# Altium schematic sheet Mako DSP Arduio IO R1.2.SchDoc
size A
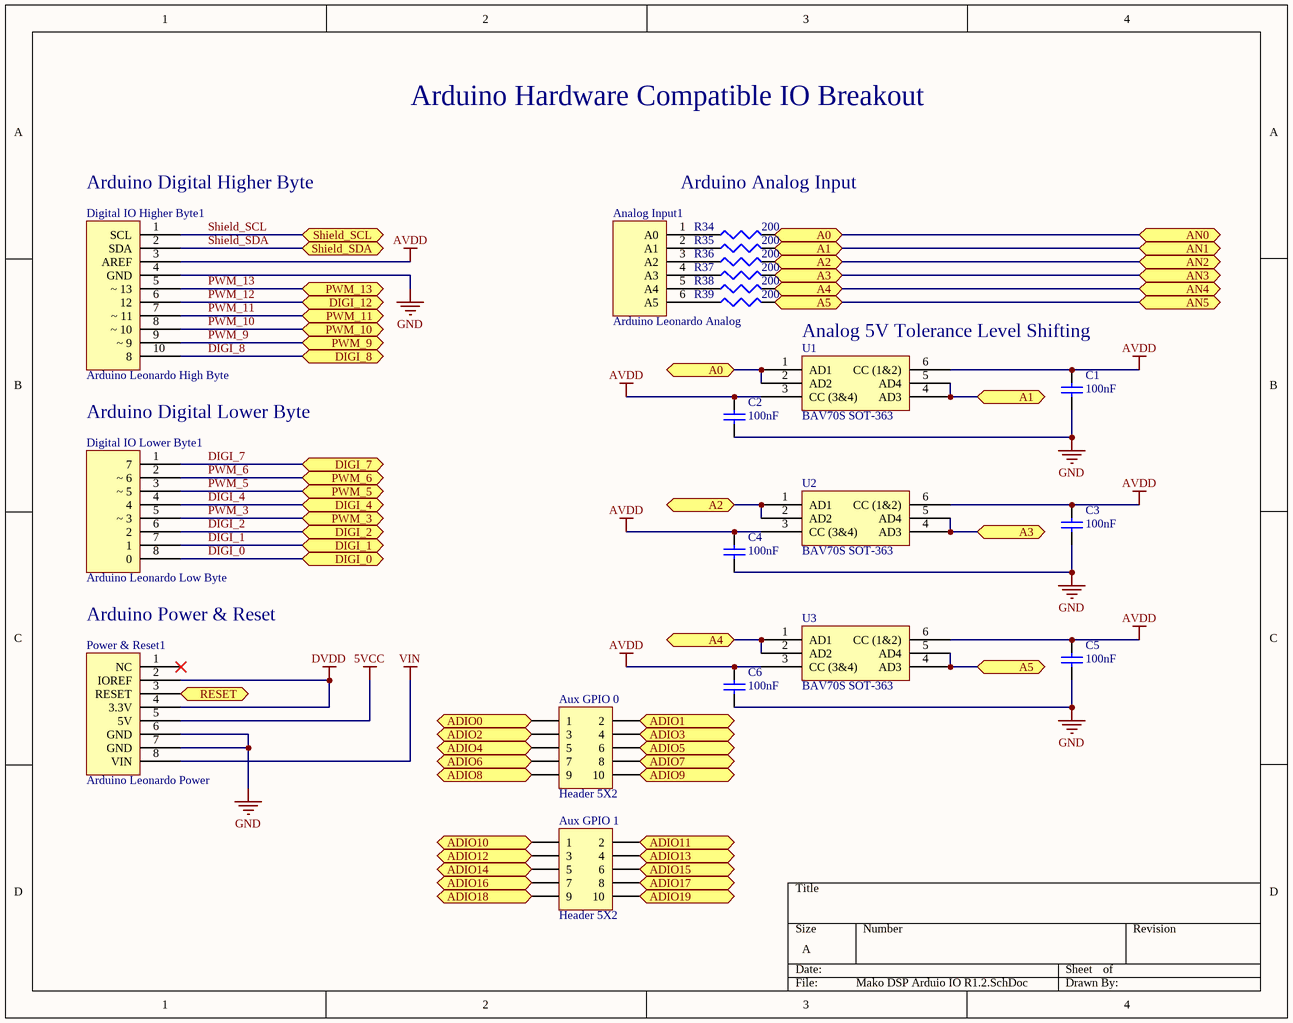
[diagram p0: Mako DSP Arduio IO R1.2.SchDoc]

## Parts
Analog_Input1  Arduino Leonardo Analog  [Arduino Leonardo Analog]
Aux_GPIO_0  Header 5X2  [HDR2X5]
Aux_GPIO_1  Header 5X2  [HDR2X5]
C1  value 100nF  [0402]  (hidden comment: Cap Semi)
C2  value 100nF  [0402]  (hidden comment: Cap Semi)
C3  value 100nF  [0402]  (hidden comment: Cap Semi)
C4  value 100nF  [0402]  (hidden comment: Cap Semi)
C5  value 100nF  [0402]  (hidden comment: Cap Semi)
C6  value 100nF  [0402]  (hidden comment: Cap Semi)
Digital_IO_Higher_Byte1  Arduino Leonardo High Byte  [Arduino Leonardo High Byte]
Digital_IO_Lower_Byte1  Arduino Leonardo Low Byte  [Arduino Leonardo Low Byte]
Power_&_Reset1  Arduino Leonardo Power  [Arduino Leonardo Power]
R34  value 200  [0402 - duplicate]  (hidden comment: Res3)
R35  value 200  [0402 - duplicate]  (hidden comment: Res3)
R36  value 200  [0402 - duplicate]  (hidden comment: Res3)
R37  value 200  [0402 - duplicate]  (hidden comment: Res3)
R38  value 200  [0402 - duplicate]  (hidden comment: Res3)
R39  value 200  [0402 - duplicate]  (hidden comment: Res3)
U1  BAV70S SOT-363  [BAV70S_SOT363]
U2  BAV70S SOT-363  [BAV70S_SOT363]
U3  BAV70S SOT-363  [BAV70S_SOT363]

## Ports
A0 (bidir), A1 (bidir), A2 (bidir), A3 (bidir), A4 (bidir), A5 (bidir), ADIO0 (bidir), ADIO1 (bidir), ADIO2 (bidir), ADIO3 (bidir), ADIO4 (bidir), ADIO5 (bidir), ADIO6 (bidir), ADIO7 (bidir), ADIO8 (bidir), ADIO9 (bidir), ADIO10 (bidir), ADIO11 (bidir), ADIO12 (bidir), ADIO13 (bidir), ADIO14 (bidir), ADIO15 (bidir), ADIO16 (bidir), ADIO17 (bidir), ADIO18 (bidir), ADIO19 (bidir), AN0 (bidir), AN1 (bidir), AN2 (bidir), AN3 (bidir), AN4 (bidir), AN5 (bidir), DIGI_0 (bidir), DIGI_1 (bidir), DIGI_2 (bidir), DIGI_4 (bidir), DIGI_7 (bidir), DIGI_8 (bidir), DIGI_12 (bidir), PWM_3 (bidir), PWM_5 (bidir), PWM_6 (bidir), PWM_9 (bidir), PWM_10 (bidir), PWM_11 (bidir), PWM_13 (bidir), RESET (bidir), Shield_SCL (bidir), Shield_SDA (bidir)

## Nets
5VCC: Power_&_Reset1.5(5V)
AVDD: C1.2 C2.2 C3.2 C4.2 C5.2 C6.2 Digital_IO_Higher_Byte1.3(AREF) U1.3(CC_(3&4)) U1.6(CC_(1&2)) U2.3(CC_(3&4)) U2.6(CC_(1&2)) U3.3(CC_(3&4)) U3.6(CC_(1&2))
DVDD: Power_&_Reset1.2(IOREF) Power_&_Reset1.4(3.3V)
GND: C1.1 C2.1 C3.1 C4.1 C5.1 C6.1 Digital_IO_Higher_Byte1.4(GND) Power_&_Reset1.6(GND) Power_&_Reset1.7(GND)
VIN: Power_&_Reset1.8(VIN)
A0: R34.2 U1.1(AD1) U1.2(AD2) ; port AN0, port A0
A1: R35.2 U1.4(AD3) U1.5(AD4) ; port AN1, port A1
A2: R36.2 U2.1(AD1) U2.2(AD2) ; port AN2, port A2
A3: R37.2 U2.4(AD3) U2.5(AD4) ; port AN3, port A3
A4: R38.2 U3.1(AD1) U3.2(AD2) ; port AN4, port A4
A5: R39.2 U3.4(AD3) U3.5(AD4) ; port AN5, port A5
ADIO0: Aux_GPIO_0.1 ; port ADIO0
ADIO1: Aux_GPIO_0.2 ; port ADIO1
ADIO2: Aux_GPIO_0.3 ; port ADIO2
ADIO3: Aux_GPIO_0.4 ; port ADIO3
ADIO4: Aux_GPIO_0.5 ; port ADIO4
ADIO5: Aux_GPIO_0.6 ; port ADIO5
ADIO6: Aux_GPIO_0.7 ; port ADIO6
ADIO7: Aux_GPIO_0.8 ; port ADIO7
ADIO8: Aux_GPIO_0.9 ; port ADIO8
ADIO9: Aux_GPIO_0.10 ; port ADIO9
ADIO10: Aux_GPIO_1.1 ; port ADIO10
ADIO11: Aux_GPIO_1.2 ; port ADIO11
ADIO12: Aux_GPIO_1.3 ; port ADIO12
ADIO13: Aux_GPIO_1.4 ; port ADIO13
ADIO14: Aux_GPIO_1.5 ; port ADIO14
ADIO15: Aux_GPIO_1.6 ; port ADIO15
ADIO16: Aux_GPIO_1.7 ; port ADIO16
ADIO17: Aux_GPIO_1.8 ; port ADIO17
ADIO18: Aux_GPIO_1.9 ; port ADIO18
ADIO19: Aux_GPIO_1.10 ; port ADIO19
DIGI_0: Digital_IO_Lower_Byte1.8(0) ; port DIGI_0
DIGI_1: Digital_IO_Lower_Byte1.7(1) ; port DIGI_1
DIGI_2: Digital_IO_Lower_Byte1.6(2) ; port DIGI_2
DIGI_4: Digital_IO_Lower_Byte1.4 ; port DIGI_4
DIGI_7: Digital_IO_Lower_Byte1.1(7) ; port DIGI_7
DIGI_8: Digital_IO_Higher_Byte1.10(8) ; port DIGI_8
PWM_3: Digital_IO_Lower_Byte1.5(~_3) ; port PWM_3
PWM_5: Digital_IO_Lower_Byte1.3(~_5) ; port PWM_5
PWM_6: Digital_IO_Lower_Byte1.2(~_6) ; port PWM_6
PWM_9: Digital_IO_Higher_Byte1.9(~_9) ; port PWM_9
PWM_10: Digital_IO_Higher_Byte1.8(~_10) ; port PWM_10
PWM_11: Digital_IO_Higher_Byte1.7(~_11) ; port PWM_11
PWM_12: Digital_IO_Higher_Byte1.6(12) ; port DIGI_12
PWM_13: Digital_IO_Higher_Byte1.5(~_13) ; port PWM_13
RESET: Power_&_Reset1.3(RESET) ; port RESET
Shield_SCL: Digital_IO_Higher_Byte1.1(SCL) ; port Shield_SCL
Shield_SDA: Digital_IO_Higher_Byte1.2(SDA) ; port Shield_SDA
NetAnalog_Input1_1: Analog_Input1.1(A0) R34.1
NetAnalog_Input1_2: Analog_Input1.2(A1) R35.1
NetAnalog_Input1_3: Analog_Input1.3(A2) R36.1
NetAnalog_Input1_4: Analog_Input1.4(A3) R37.1
NetAnalog_Input1_5: Analog_Input1.5(A4) R38.1
NetAnalog_Input1_6: Analog_Input1.6(A5) R39.1

Not connected (* = marked no-connect by the designer): Power_&_Reset1 1(NC)*

## Notes on the sheet
- Arduino Hardware Compatible IO Breakout
- (near Digital_IO_Higher_Byte1) Arduino Digital Higher Byte
- Arduino Analog Input
- Analog 5V Tolerance Level Shifting
- Arduino Digital Lower Byte
- Arduino Power & Reset

## Library data of the parts
Aux_GPIO_0 Aux_GPIO_1 = Header 5X2: Header, 5-Pin, Dual row; LatestRevisionDate: 17-Jul-2002; LatestRevisionNote: Re-released for DXP Platform.; Publisher: Altium Limited
C1-C6 = Cap Semi: Capacitor (Semiconductor SIM Model); Published: 8-Jun-2000; LatestRevisionDate: 29-May-2009; LatestRevisionNote: IPC-7351 Footprint Added.; PackageReference: C1206; Publisher: Altium Limited; PackageDescription: Chip Capacitor
R34-R39 = Res3: Resistor; Published: 8-Jun-2000; LatestRevisionDate: 29-May-2009; LatestRevisionNote: IPC-7351 Footprint Added.; PackageReference: J1-0603; Publisher: Altium Limited; PackageDescription: Chip Resistor